# Altium schematic sheet BLOCK.SchDoc
size A3; DrawnBy: Anne Moller; Organization: Altium Limited; Address1: L3, 12a Rodborough Rd; Address2: Frenchs Forest; Address3: NSW; Address4: Australia 2086
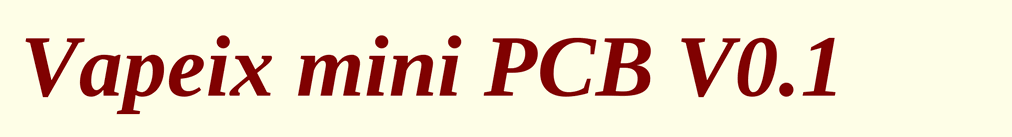
[diagram p0: BLOCK.SchDoc]

## Notes on the sheet
- Labels drawn without touching a wire or pin: Vapeix mini PCB V0.1
- Title
- Size:
- Date:
- A3
- Number:
- Time:
- Revision:
- Sheet
- of
- Drawn by:
- File: